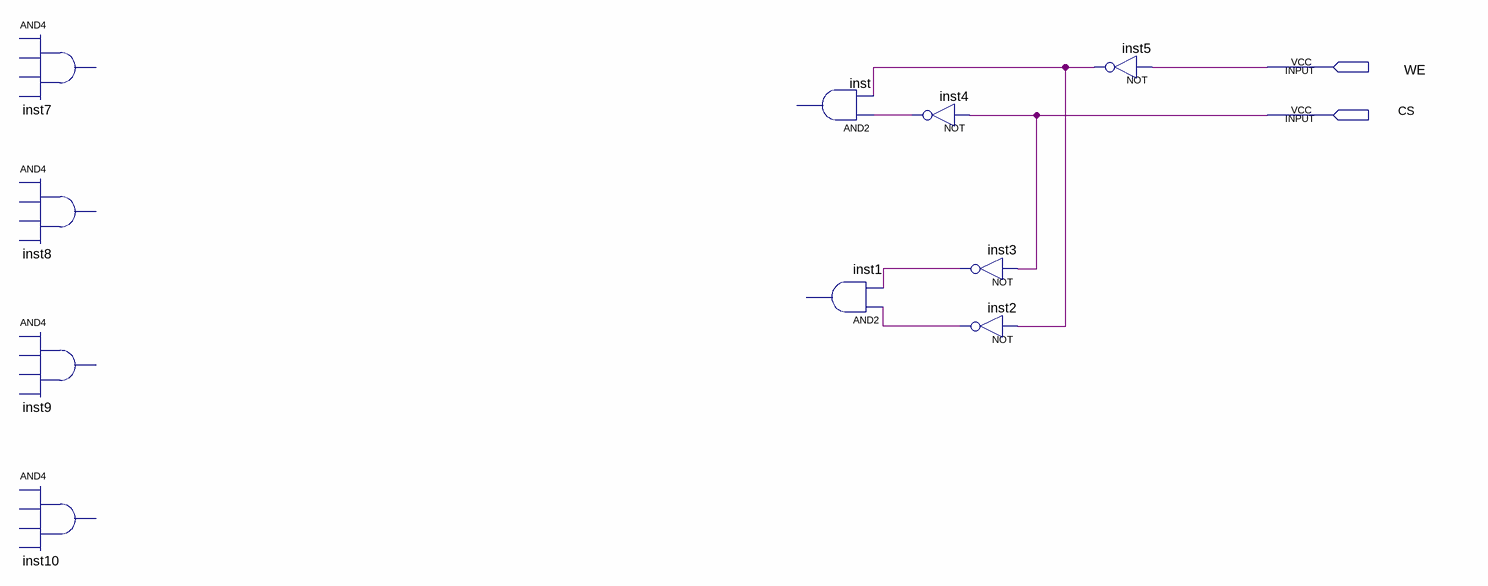
[diagram p0: schematic sheet]
// Quartus schematic CI_74F189-RAM.bdf as structural Verilog: 10 symbols, 2 pins
module \CI_74F189-RAM  (
  input  WE,
  input  CS
);

  wire inst2_out, inst3_out, inst4_out, inst5_out;

  // AND4 inst7 is placed but not wired
  // AND4 inst8 is placed but not wired
  // AND4 inst9 is placed but not wired
  // AND4 inst10 is placed but not wired
  // AND2 inst has open pins: IN1=inst4_out, IN2=inst5_out, OUT=open
  // AND2 inst1 has open pins: IN1=inst2_out, IN2=inst3_out, OUT=open
  not inst4 (inst4_out, CS);
  not inst3 (inst3_out, CS);
  not inst2 (inst2_out, inst5_out);
  not inst5 (inst5_out, WE);
endmodule
